# EAGLE schematic Player_v0.3_simplified (EAGLE 6.2)

## Sheet 1 of 2: Player Board main
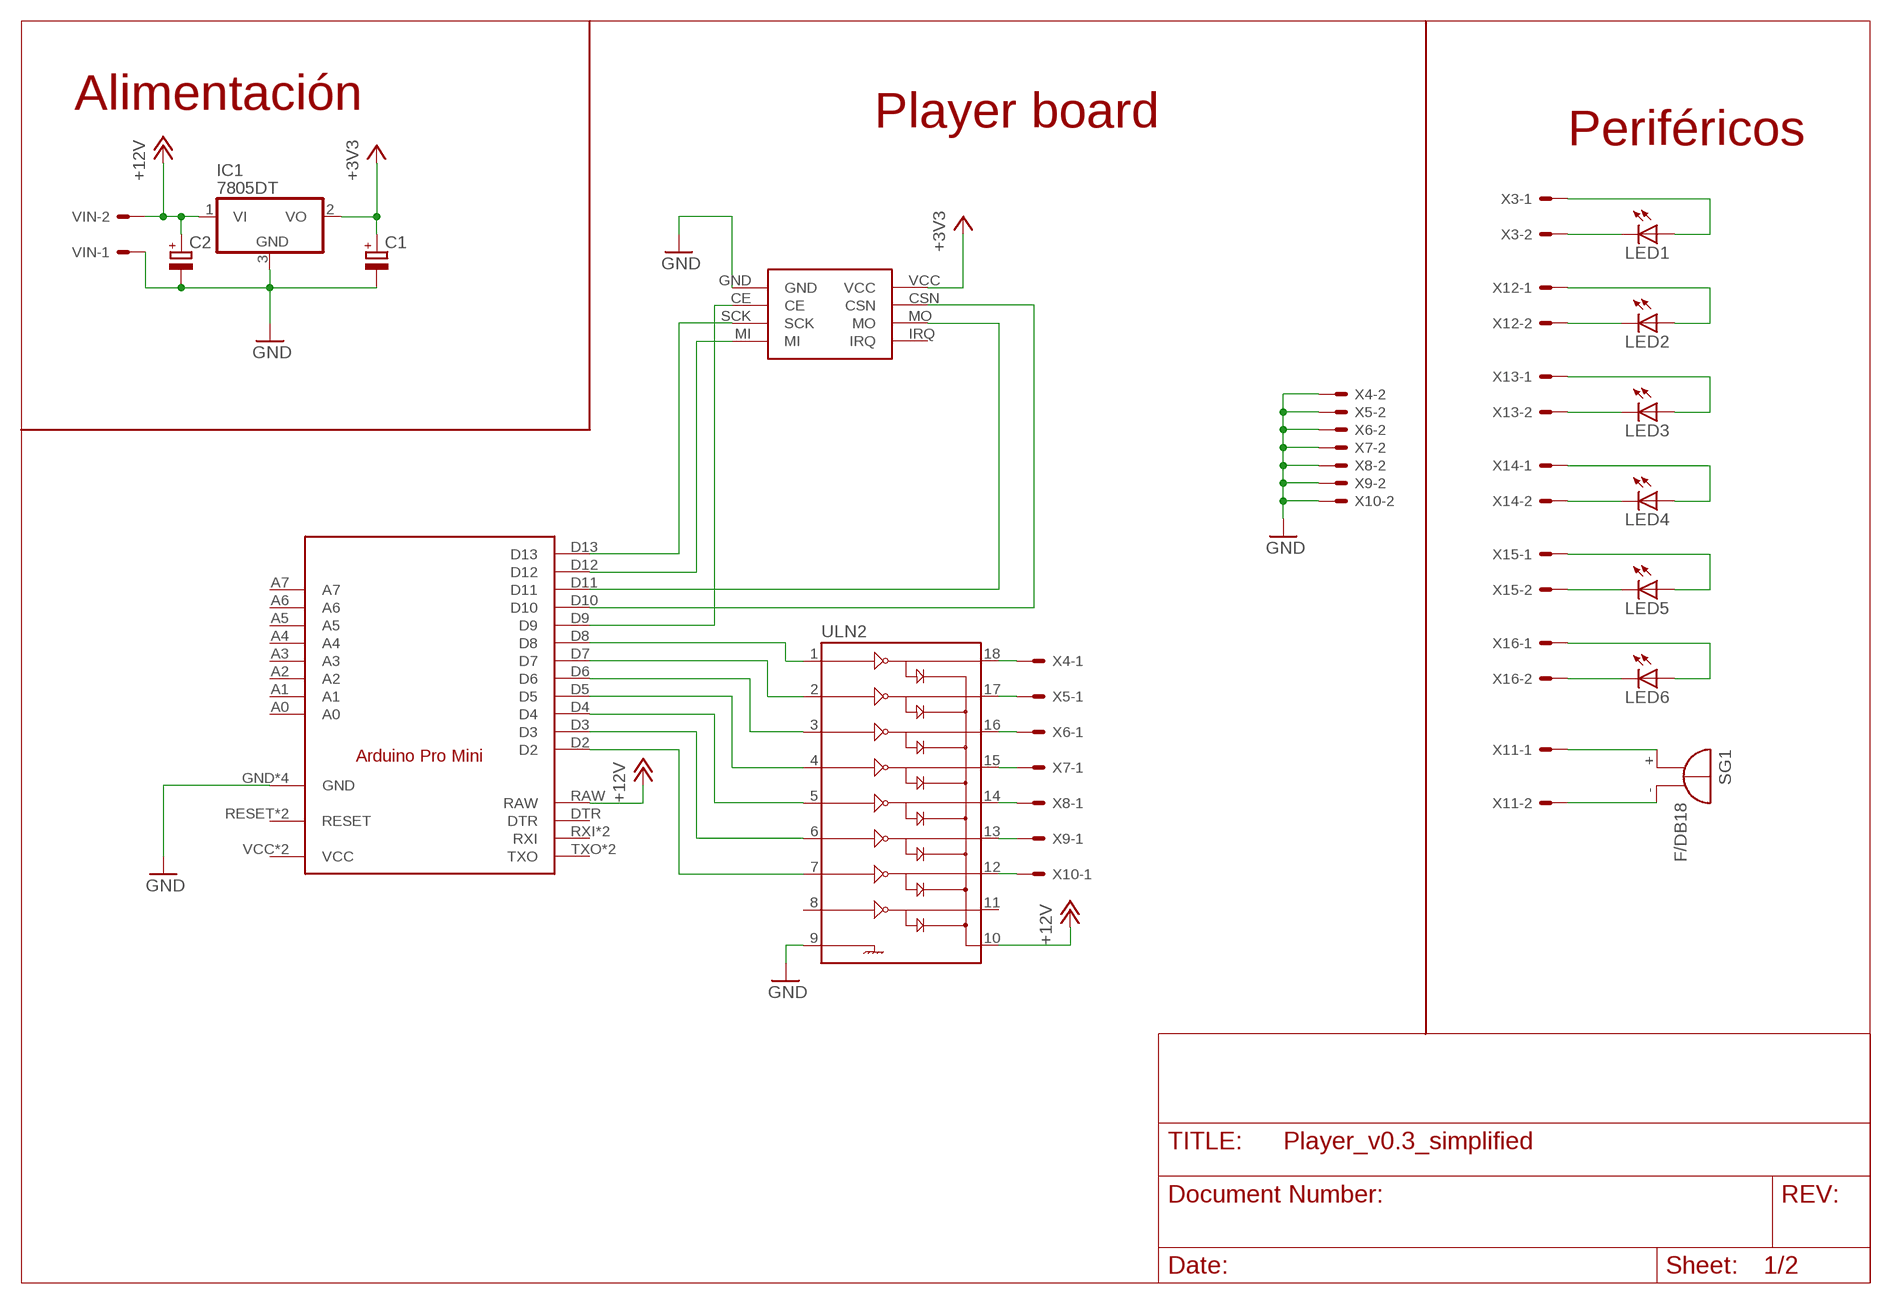
[diagram p0: schematic, sheet 1]

### Parts
C1  CPOL-EUE2.5-5  [E2,5-5]
C2  CPOL-EUE2.5-5  [E2,5-5]
IC1  7805DT  [TO252]
LED1  LED5MM  [LED5MM]
LED2  LED5MM  [LED5MM]
LED3  LED5MM  [LED5MM]
LED4  LED5MM  [LED5MM]
LED5  LED5MM  [LED5MM]
LED6  LED5MM  [LED5MM]
SG1  F/DB18  [F/DB18]
U$1  ARDUINO_PRO_MINI  [ARDUINO_PRO_MINI]
U$5  NRF24L01_8PIN  [NRF24L01_8PIN]
ULN2  ULN2803SOIC  [SO018]
VIN  KK-156-2  [KK-156-2]
X3  KK-156-2  [KK-156-2]
X4  KK-156-2  [KK-156-2]
X5  KK-156-2  [KK-156-2]
X6  KK-156-2  [KK-156-2]
X7  KK-156-2  [KK-156-2]
X8  KK-156-2  [KK-156-2]
X9  KK-156-2  [KK-156-2]
X10  KK-156-2  [KK-156-2]
X11  KK-156-2  [KK-156-2]
X12  KK-156-2  [KK-156-2]
X13  KK-156-2  [KK-156-2]
X14  KK-156-2  [KK-156-2]
X15  KK-156-2  [KK-156-2]
X16  KK-156-2  [KK-156-2]

### Nets
+3V3: C1.+ IC1.2(VO) U$5.VCC ; also sheet 2
+12V: C2.+ IC1.1(VI) U$1.RAW ULN2.10 VIN.2 ; also sheet 2
GND: C1.- C2.- U$1.GND U$1.GND1(GND) U$1.GND2(GND) U$1.GND3(GND) U$5.GND ULN2.9 VIN.1 X4.2 X5.2 X6.2 X7.2 X8.2 X9.2 X10.2 ; also sheet 2
N$1: U$1.D7 ULN2.2
N$2: U$1.D3 ULN2.6
N$3: U$1.D5 ULN2.4
N$4: U$1.D6 ULN2.3
N$5: ULN2.18 X4.1
N$6: ULN2.17 X5.1
N$7: ULN2.16 X6.1
N$8: ULN2.15 X7.1
N$9: U$1.D12 U$5.MI
N$10: U$1.D11 U$5.MO
N$11: U$1.D13 U$5.SCK
N$12: U$1.D10 U$5.CSN
N$13: ULN2.14 X8.1
N$14: ULN2.13 X9.1
N$15: ULN2.12 X10.1
N$16: LED1.A X3.1
N$18: U$1.D9 U$5.CE
N$21: U$1.D2 ULN2.7
N$25: LED1.K(C) X3.2
N$26: LED2.A X12.1
N$27: LED2.K(C) X12.2
N$28: U$1.D8 ULN2.1
N$29: LED3.A X13.1
N$30: LED3.K(C) X13.2
N$31: LED4.A X14.1
N$32: U$1.D4 ULN2.5
N$34: LED4.K(C) X14.2
N$35: LED5.A X15.1
N$36: LED5.K(C) X15.2
N$37: LED6.A X16.1
N$38: LED6.K(C) X16.2
N$47: SG1.+ X11.1
N$48: SG1.- X11.2
Unconnected: IC1.3(GND) U$1.A0 U$1.A1 U$1.A2 U$1.A3 U$1.A4 U$1.A5 U$1.A6 U$1.A7 U$1.DTR U$1.RESET U$1.RESET1(RESET) U$1.RXI U$1.RXI1(RXI) U$1.TXO U$1.TXO1(TXO) U$1.VCC U$1.VCC1(VCC) U$5.IRQ ULN2.8 ULN2.11

### Notes on the sheet
- Alimentación
- Player board
- Periféricos

## Sheet 2 of 2: Control Board
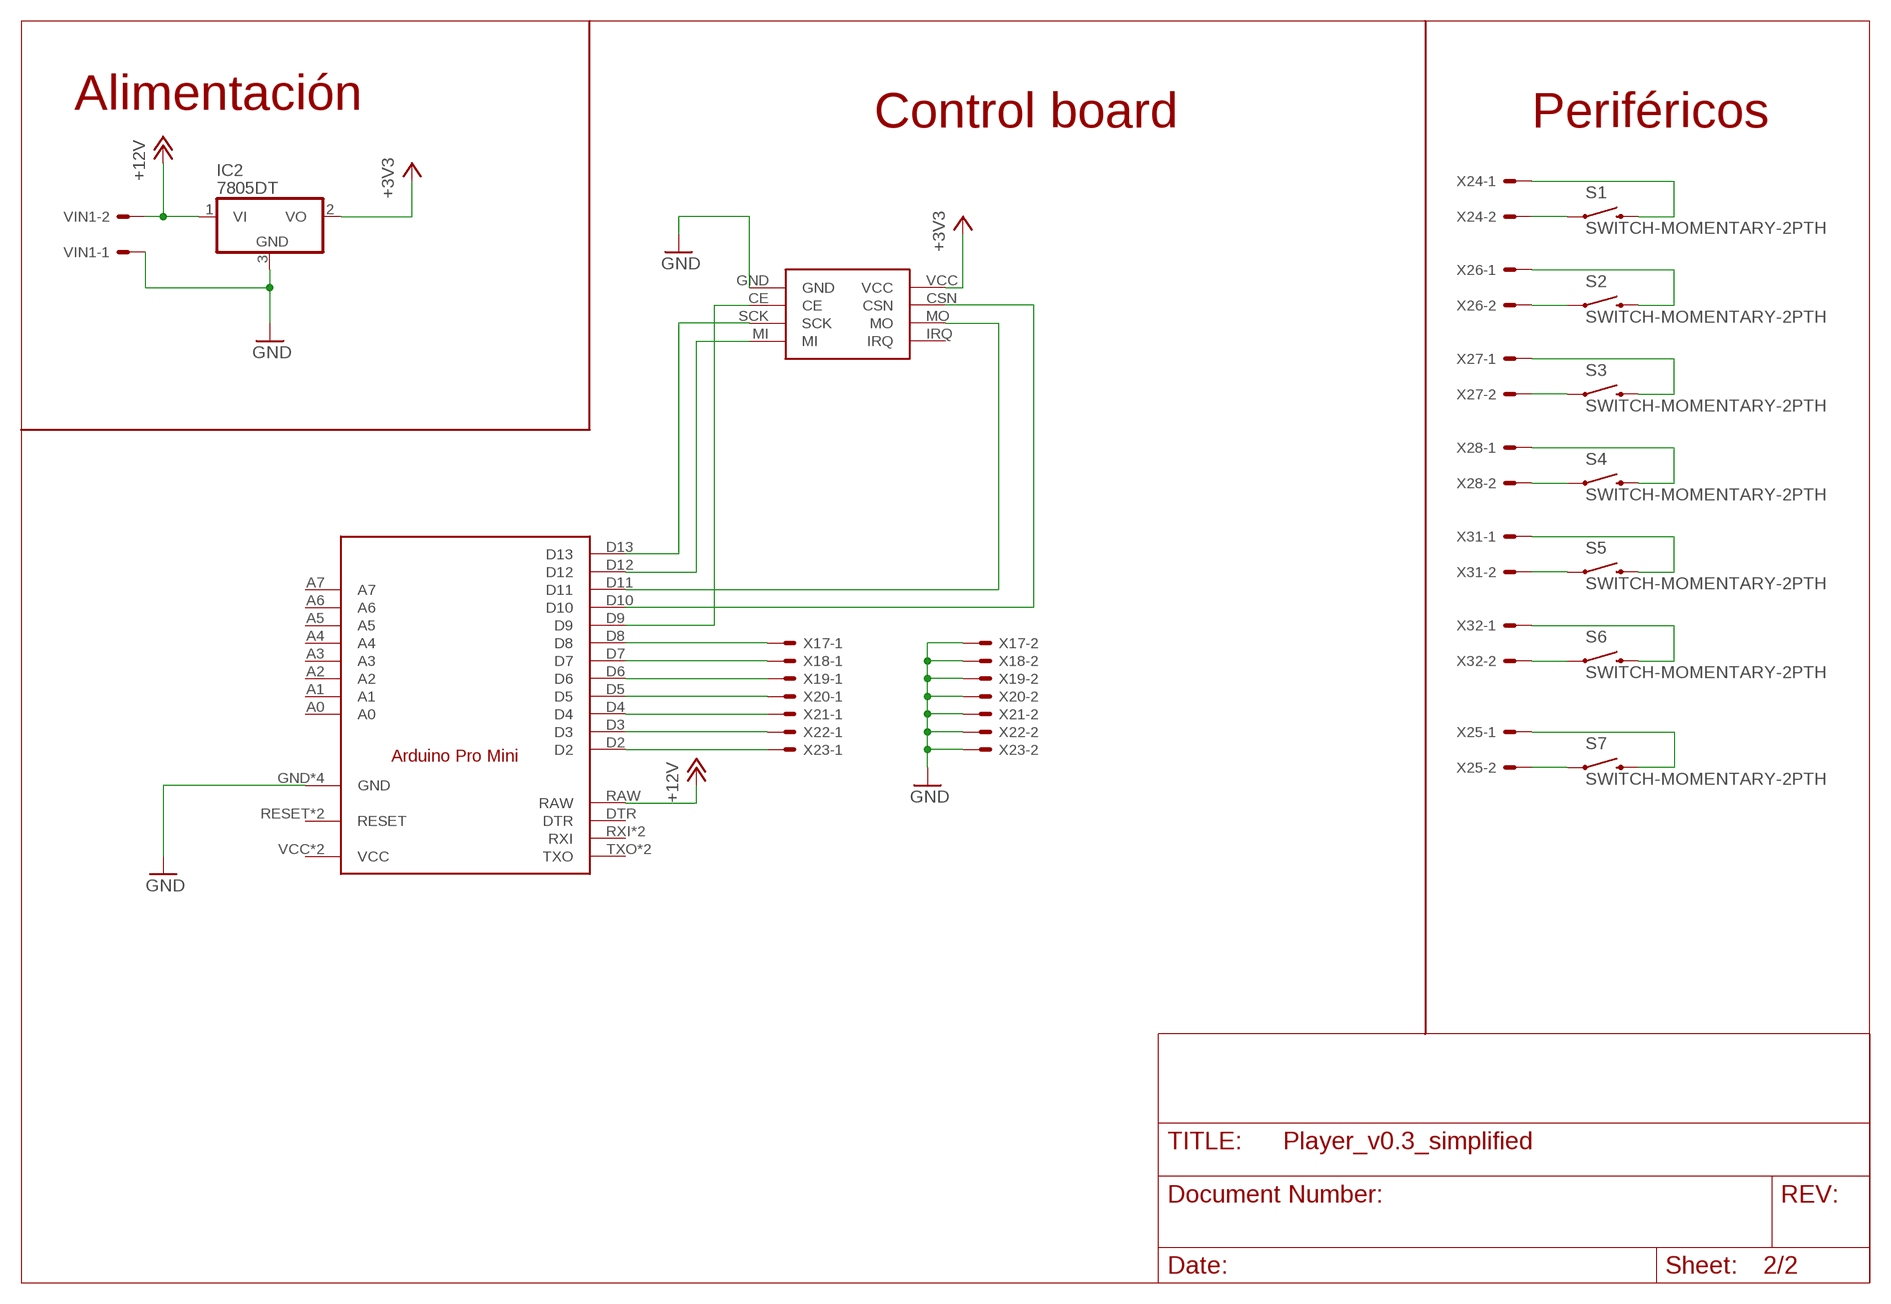
[diagram p1: schematic, sheet 2]

### Parts
IC2  7805DT  [TO252]
S1  SWITCH-MOMENTARY-2PTH  [TACTILE-PTH]
S2  SWITCH-MOMENTARY-2PTH  [TACTILE-PTH]
S3  SWITCH-MOMENTARY-2PTH  [TACTILE-PTH]
S4  SWITCH-MOMENTARY-2PTH  [TACTILE-PTH]
S5  SWITCH-MOMENTARY-2PTH  [TACTILE-PTH]
S6  SWITCH-MOMENTARY-2PTH  [TACTILE-PTH]
S7  SWITCH-MOMENTARY-2PTH  [TACTILE-PTH]
U$2  NRF24L01_8PIN  [NRF24L01_8PIN]
U$3  ARDUINO_PRO_MINI  [ARDUINO_PRO_MINI]
VIN1  KK-156-2  [KK-156-2]
X17  KK-156-2  [KK-156-2]
X18  KK-156-2  [KK-156-2]
X19  KK-156-2  [KK-156-2]
X20  KK-156-2  [KK-156-2]
X21  KK-156-2  [KK-156-2]
X22  KK-156-2  [KK-156-2]
X23  KK-156-2  [KK-156-2]
X24  KK-156-2  [KK-156-2]
X25  KK-156-2  [KK-156-2]
X26  KK-156-2  [KK-156-2]
X27  KK-156-2  [KK-156-2]
X28  KK-156-2  [KK-156-2]
X31  KK-156-2  [KK-156-2]
X32  KK-156-2  [KK-156-2]

### Nets
+3V3: IC2.2(VO) U$2.VCC ; also sheet 1
+12V: IC2.1(VI) U$3.RAW VIN1.2 ; also sheet 1
GND: U$2.GND U$3.GND U$3.GND1(GND) U$3.GND2(GND) U$3.GND3(GND) VIN1.1 X17.2 X18.2 X19.2 X20.2 X21.2 X22.2 X23.2 ; also sheet 1
N$17: U$2.MI U$3.D12
N$19: U$2.MO U$3.D11
N$20: U$2.SCK U$3.D13
N$23: U$2.CSN U$3.D10
N$24: U$2.CE
N$39: U$3.D5 X20.1
N$40: U$3.D6 X19.1
N$41: U$3.D8 X17.1
N$42: U$3.D3 X22.1
N$43: U$3.D4 X21.1
N$44: U$3.D7 X18.1
N$45: U$3.D9
N$46: U$3.D2 X23.1
N$49: S1.3 X24.1
N$50: S2.3 X26.1
N$51: S3.3 X27.1
N$52: S4.3 X28.1
N$53: S5.3 X31.1
N$55: S6.3 X32.1
N$57: S7.3 X25.1
N$59: S7.1 X25.2
N$61: S6.1 X32.2
N$63: S5.1 X31.2
N$65: S4.1 X28.2
N$73: S3.1 X27.2
N$74: S2.1 X26.2
N$75: S1.1 X24.2
Unconnected: IC2.3(GND) U$2.IRQ U$3.A0 U$3.A1 U$3.A2 U$3.A3 U$3.A4 U$3.A5 U$3.A6 U$3.A7 U$3.DTR U$3.RESET U$3.RESET1(RESET) U$3.RXI U$3.RXI1(RXI) U$3.TXO U$3.TXO1(TXO) U$3.VCC U$3.VCC1(VCC)

### Notes on the sheet
- Alimentación
- Control board | Periféricos

## Library data of the parts
C1 C2 = rcl:CPOL-EU: POLARIZED CAPACITOR, European symbol
IC1 IC2 = linear:78*: Positive VOLTAGE REGULATOR Source: http://cache.national.com/ds/LM/LM78L05.pdf http://www.fairchildsemi.com/ds/LM/LM7805.pdf
LED1-LED6 = adafruit:LED: LED OSRAM: - CHIPLED LG R971, LG N971, LY N971, LG Q971, LY Q971, LO R971, LY R971 LH N974, LH R974 LS Q976, LO Q976, LY Q976 LO Q996 - Hyper CHIPLED LW Q18S LB Q993, LB Q99A, LB R99A - SideLED LS A670, LO A670, LY A670, LG A670, LP A670 LB A673, LV A673, LT A673, LW A673 LH A674 LY A675 LS A676, LA A676, LO A676, LY A676, LW A676 LS A679, LY A679, LG A679 - Hyper Micro SIDELED® LS Y876, LA Y876, LO Y876, LY Y876 LT Y87S - SmartLED LW L88C, LW L88S LB L89C, LB L89S, LG L890 LS L89K, LO L89K, LY L89K LS L896, LA L896, LO L896, LY L896 - TOPLED LS T670, LO T670, LY T670, LG T670, LP T670 LSG T670, LSP T670, LSY T670, LOP T670, LYG T670 LG T671, LOG T671, LSG T671 LB T673, LV T673, LT T673, LW T673 LH T674 LS T676, LA T676, LO T676, LY T676, LB T676, LH T676, LSB T676, LW T676 LB T67C, LV T67C, LT T67C, LS T67K, LO T67K, LY T67K, LW E67C LS E67B, LA E67B, LO E67B, LY E67B, LB E67C, LV E67C, LT E67C LW T67C LS T679, LY T679, LG T679 LS T770, LO T770, LY T770, LG T770, LP T770 LB T773, LV T773, LT T773, LW T773 LH T774 LS E675, LA E675, LY E675, LS T675 LS T776, LA T776, LO T776, LY T776, LB T776 LHGB T686 LT T68C, LB T68C - Hyper Mini TOPLED® LB M676 - Mini TOPLED Santana® LG M470 LS M47K, LO M47K, LY M47K Source: http://www.osram.convergy.de/
S1-S7 = SparkFun-Electromechanical:SWITCH-MOMENTARY-2: Various NO switches- pushbuttons, reed, etc
SG1 = buzzer:F/DB18: BUZZER Source: Buerklin; OC_FARNELL: unknown; OC_NEWARK: unknown
U$1 U$3 = MimaZ:ARDUINO_PRO_MINI: Arduino Pro Mini http://arduino.cc/en/Main/ArduinoBoardProMini
U$2 U$5 = nrf24l01_DealExtreme:NRF24L01_8PIN
ULN2 = SparkFun-PowerIC:ULN2803: Darlington Driver ULN2803 Darlington array. 500mA max per channel, 8-channel package. Spark Fun Electronics SKU : COM-00312
VIN VIN1 X3-X28 X31 X32 = con-molex:KK-156-2: KK 156 HEADER Source: http://www.molex.com/pdm_docs/sd/026604100_sd.pdf; OC_FARNELL: unknown; OC_NEWARK: unknown